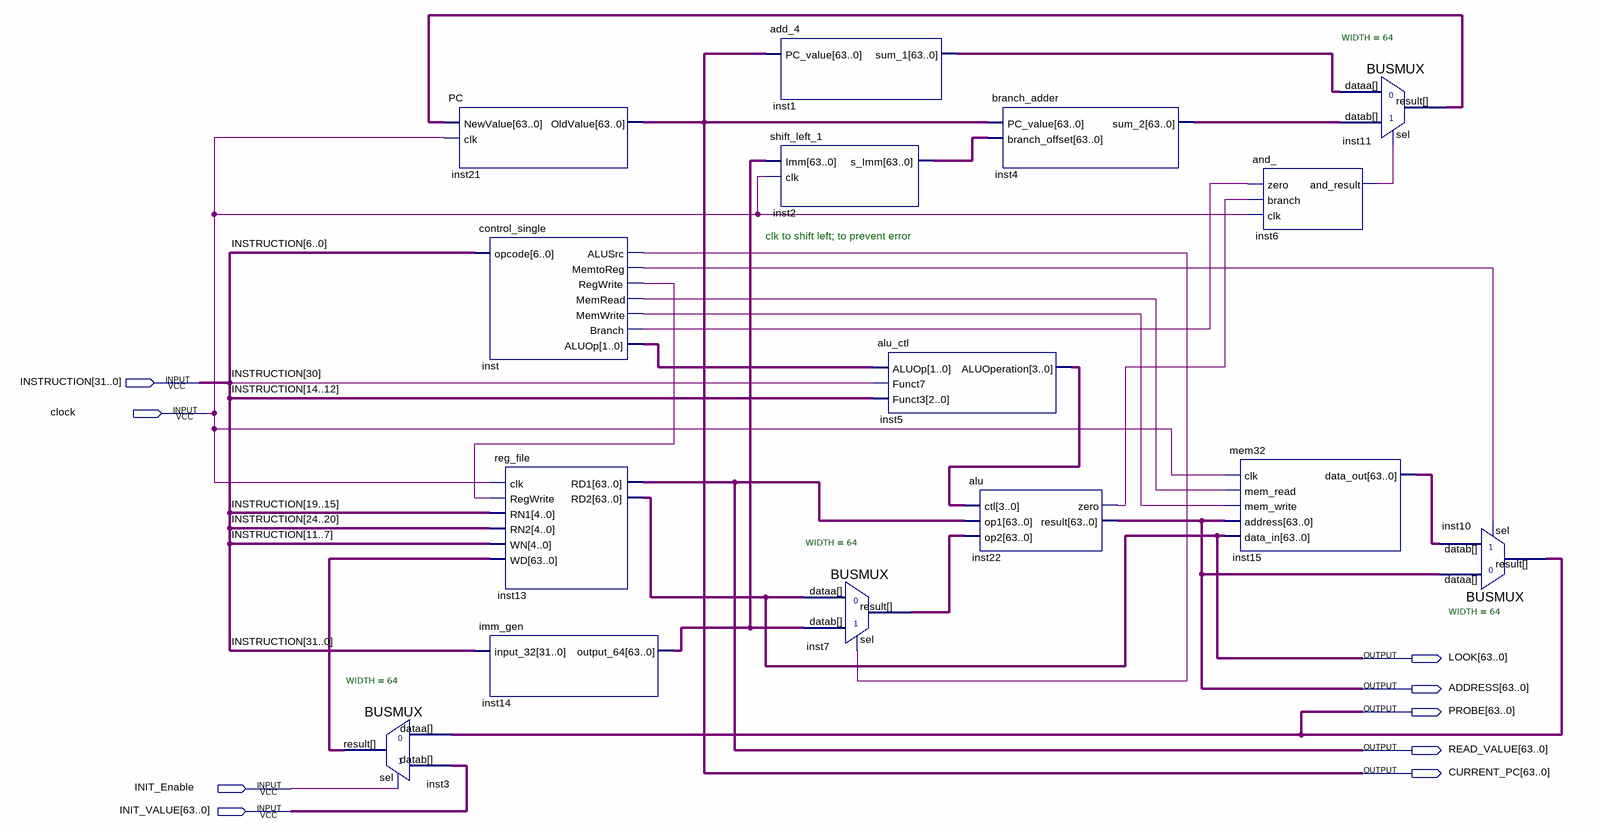
[diagram p0: schematic sheet]
// Quartus schematic top_level_KSY.bdf as structural Verilog: 15 symbols, 9 pins
module top_level_KSY (
  input  [31:0] INSTRUCTION,
  input  clock,
  input  INIT_Enable,
  input  [63:0] INIT_VALUE,
  output [63:0] LOOK,
  output [63:0] ADDRESS,
  output [63:0] PROBE,
  output [63:0] READ_VALUE,
  output [63:0] CURRENT_PC
);

  wire inst6_and_result, inst22_zero, inst_alusrc, inst_branch, inst_memread, inst_memtoreg, inst_memwrite,
       inst_regwrite;
  wire [1:0] inst_aluop;
  wire [3:0] inst5_aluoperation;
  wire [63:0] inst1_sum_1, inst2_s_imm, inst3_result, inst4_sum_2, inst7_result, inst11_result,
       inst14_output_64, inst15_data_out;

  BUSMUX #(.WIDTH(64)) inst3 (.datab(INIT_VALUE), .sel(INIT_Enable), .dataa(PROBE), .result(inst3_result));
  PC inst21 (.NewValue(inst11_result), .clk(clock), .OldValue(CURRENT_PC));
  control_single inst (
    .opcode(INSTRUCTION[6:0]), .ALUSrc(inst_alusrc), .MemtoReg(inst_memtoreg), .RegWrite(inst_regwrite),
    .MemRead(inst_memread), .MemWrite(inst_memwrite), .Branch(inst_branch), .ALUOp(inst_aluop));
  reg_file inst13 (
    .clk(clock), .RegWrite(inst_regwrite), .RN1(INSTRUCTION[19:15]), .RN2(INSTRUCTION[24:20]),
    .WN(INSTRUCTION[11:7]), .WD(inst3_result), .RD1(READ_VALUE), .RD2(LOOK));
  imm_gen inst14 (.input_32(INSTRUCTION), .output_64(inst14_output_64));
  add_4 inst1 (.PC_value(CURRENT_PC), .sum_1(inst1_sum_1));
  shift_left_1 inst2 (.Imm(inst14_output_64), .clk(clock), .s_Imm(inst2_s_imm));
  BUSMUX #(.WIDTH(64)) inst7 (.datab(inst14_output_64), .sel(inst_alusrc), .dataa(LOOK), .result(inst7_result));
  alu_ctl inst5 (
    .ALUOp(inst_aluop), .Funct7(INSTRUCTION[30]), .Funct3(INSTRUCTION[14:12]),
    .ALUOperation(inst5_aluoperation));
  branch_adder inst4 (.PC_value(CURRENT_PC), .branch_offset(inst2_s_imm), .sum_2(inst4_sum_2));
  alu inst22 (.ctl(inst5_aluoperation), .op1(READ_VALUE), .op2(inst7_result), .zero(inst22_zero), .result(ADDRESS));
  and_ inst6 (.zero(inst_branch), .branch(inst22_zero), .clk(clock), .and_result(inst6_and_result));
  mem32 inst15 (
    .clk(clock), .mem_read(inst_memread), .mem_write(inst_memwrite), .address(ADDRESS), .data_in(LOOK),
    .data_out(inst15_data_out));
  BUSMUX #(.WIDTH(64)) inst11 (
    .datab(inst4_sum_2), .sel(inst6_and_result), .dataa(inst1_sum_1), .result(inst11_result));
  BUSMUX #(.WIDTH(64)) inst10 (.datab(inst15_data_out), .sel(inst_memtoreg), .dataa(ADDRESS), .result(PROBE));

  // Notes on the sheet:
  //   clk to shift left; to prevent error
endmodule
